# EAGLE design XWiFi (EAGLE 6.3)
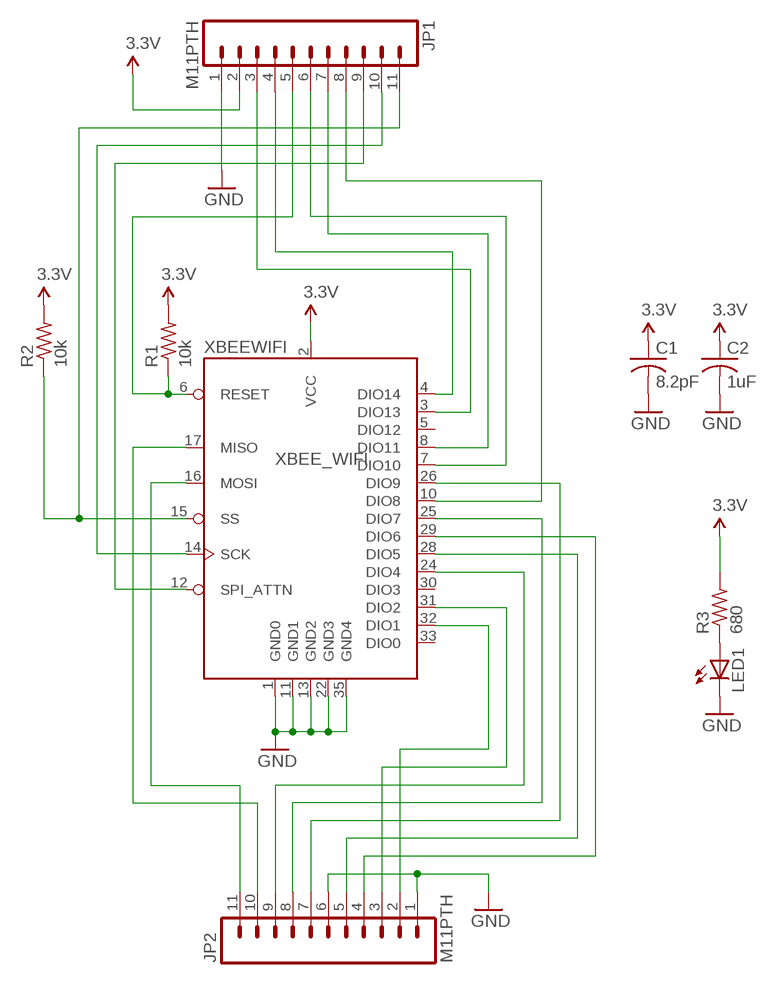
[diagram p0: schematic, sheet 1]

## Parts
C1  8.2pF  0603_CAP  [0603_RESISTOR]
C2  1uF  0603_CAP  [0603_RESISTOR]
JP1  M11PTH  [1X11]
JP2  M11PTH  [1X11]
LED1  LEDCHIP-LED0603  [CHIP-LED0603]
R1  10k  0603_RESISTOR  [0603_RESISTOR]
R2  10k  0603_RESISTOR  [0603_RESISTOR]
R3  680  0603_RESISTOR  [0603_RESISTOR]
XBEEWIFI  XBEE_WIFI  [XBEE_WIFI]

## Nets
3.3V: C1.1 C2.1 JP1.2 R1.2 R2.2 R3.2 XBEEWIFI.2(VCC)
GND: C1.2 C2.2 JP1.1 JP2.1 JP2.6 LED1.C XBEEWIFI.1(GND0) XBEEWIFI.11(GND1) XBEEWIFI.13(GND2) XBEEWIFI.22(GND3) XBEEWIFI.35(GND4)
N$1: JP1.5 R1.1 XBEEWIFI.6(RESET)
N$2: JP1.11 R2.1 XBEEWIFI.15(SS)
N$3: LED1.A R3.1
N$4: JP1.3 XBEEWIFI.3(DIO13)
N$5: JP1.4 XBEEWIFI.4(DIO14)
N$6: JP1.6 XBEEWIFI.7(DIO10)
N$8: JP1.7 XBEEWIFI.8(DIO11)
N$9: JP2.9 XBEEWIFI.24(DIO4)
N$10: JP1.8 XBEEWIFI.10(DIO8)
N$11: JP1.9 XBEEWIFI.12(SPI_ATTN)
N$13: JP1.10 XBEEWIFI.14(SCK)
N$16: JP2.11 XBEEWIFI.16(MOSI)
N$17: JP2.3 XBEEWIFI.31(DIO2)
N$18: JP2.2 XBEEWIFI.32(DIO1)
N$19: JP2.8 XBEEWIFI.25(DIO7)
N$20: JP2.7 XBEEWIFI.26(DIO9)
N$21: JP2.5 XBEEWIFI.28(DIO5)
N$22: JP2.4 XBEEWIFI.29(DIO6)
N$27: JP2.10 XBEEWIFI.17(MISO)
Unconnected: XBEEWIFI.5(DIO12) XBEEWIFI.30(DIO3) XBEEWIFI.33(DIO0)

## Library data of the parts
C1 C2 = jkf-parts:0603_CAP: 0603 Capacitor
JP1 JP2 = SparkFun-Connectors:M11: Header 11 Standard 11-pin 0.1" header. Use with straight break away headers (SKU : PRT-00116), right angle break away headers (PRT-00553), swiss pins (PRT-00743), machine pins (PRT-00117), and female headers (PRT-00115).
LED1 = adafruit:LED: LED OSRAM: - CHIPLED LG R971, LG N971, LY N971, LG Q971, LY Q971, LO R971, LY R971 LH N974, LH R974 LS Q976, LO Q976, LY Q976 LO Q996 - Hyper CHIPLED LW Q18S LB Q993, LB Q99A, LB R99A - SideLED LS A670, LO A670, LY A670, LG A670, LP A670 LB A673, LV A673, LT A673, LW A673 LH A674 LY A675 LS A676, LA A676, LO A676, LY A676, LW A676 LS A679, LY A679, LG A679 - Hyper Micro SIDELED® LS Y876, LA Y876, LO Y876, LY Y876 LT Y87S - SmartLED LW L88C, LW L88S LB L89C, LB L89S, LG L890 LS L89K, LO L89K, LY L89K LS L896, LA L896, LO L896, LY L896 - TOPLED LS T670, LO T670, LY T670, LG T670, LP T670 LSG T670, LSP T670, LSY T670, LOP T670, LYG T670 LG T671, LOG T671, LSG T671 LB T673, LV T673, LT T673, LW T673 LH T674 LS T676, LA T676, LO T676, LY T676, LB T676, LH T676, LSB T676, LW T676 LB T67C, LV T67C, LT T67C, LS T67K, LO T67K, LY T67K, LW E67C LS E67B, LA E67B, LO E67B, LY E67B, LB E67C, LV E67C, LT E67C LW T67C LS T679, LY T679, LG T679 LS T770, LO T770, LY T770, LG T770, LP T770 LB T773, LV T773, LT T773, LW T773 LH T774 LS E675, LA E675, LY E675, LS T675 LS T776, LA T776, LO T776, LY T776, LB T776 LHGB T686 LT T68C, LB T68C - Hyper Mini TOPLED® LB M676 - Mini TOPLED Santana® LG M470 LS M47K, LO M47K, LY M47K Source: http://www.osram.convergy.de/
R1-R3 = jkf-parts:0603_RESISTOR
XBEEWIFI = jkf:XBEE_WIFI

## Board
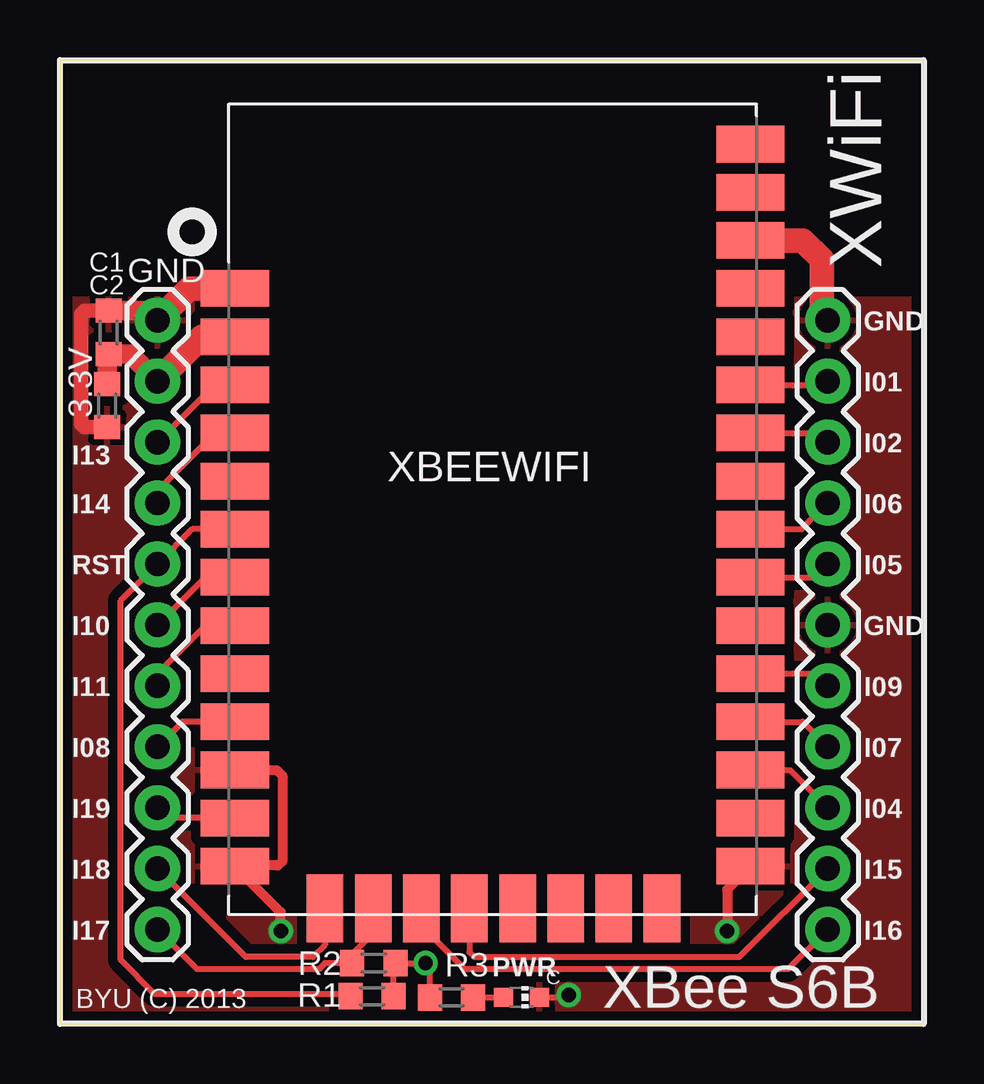
[diagram p1: board, top side]
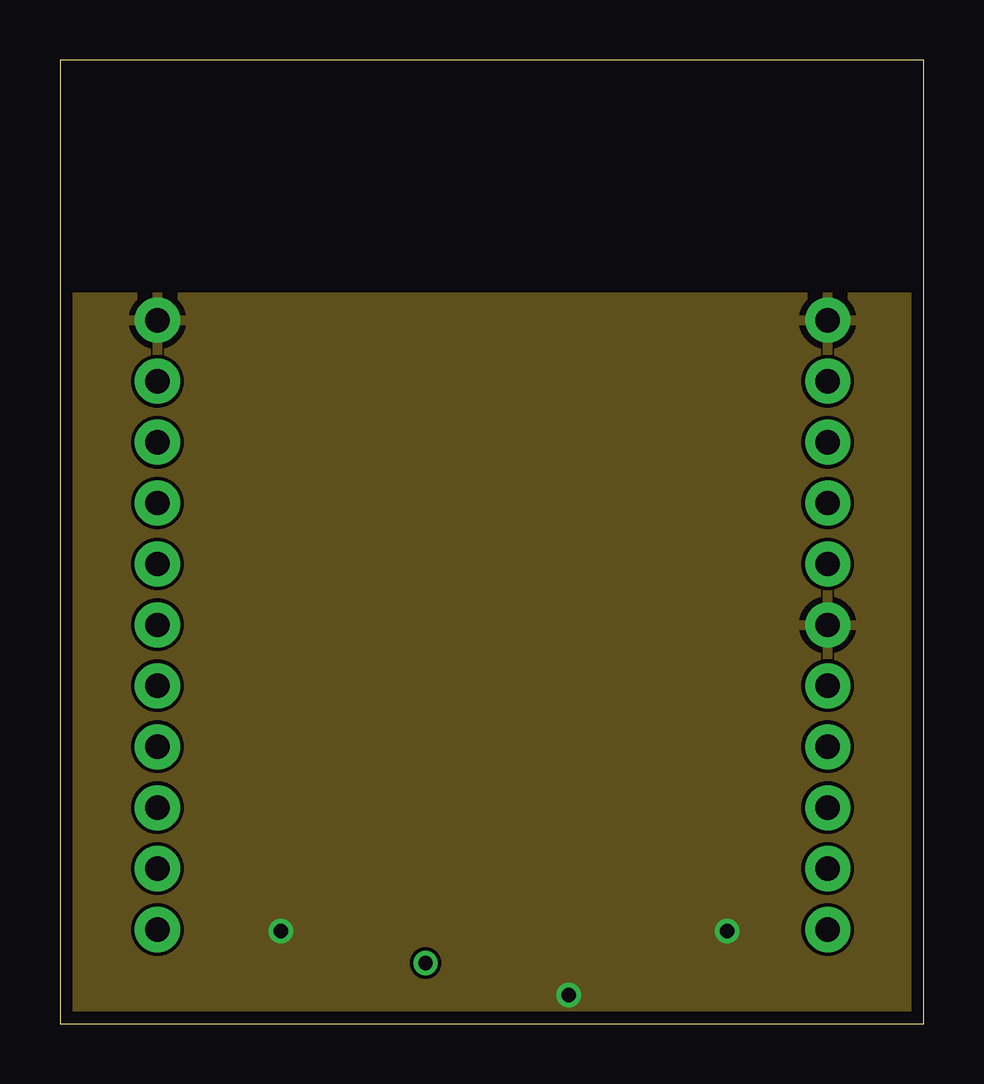
[diagram p2: board, inner layer GND]
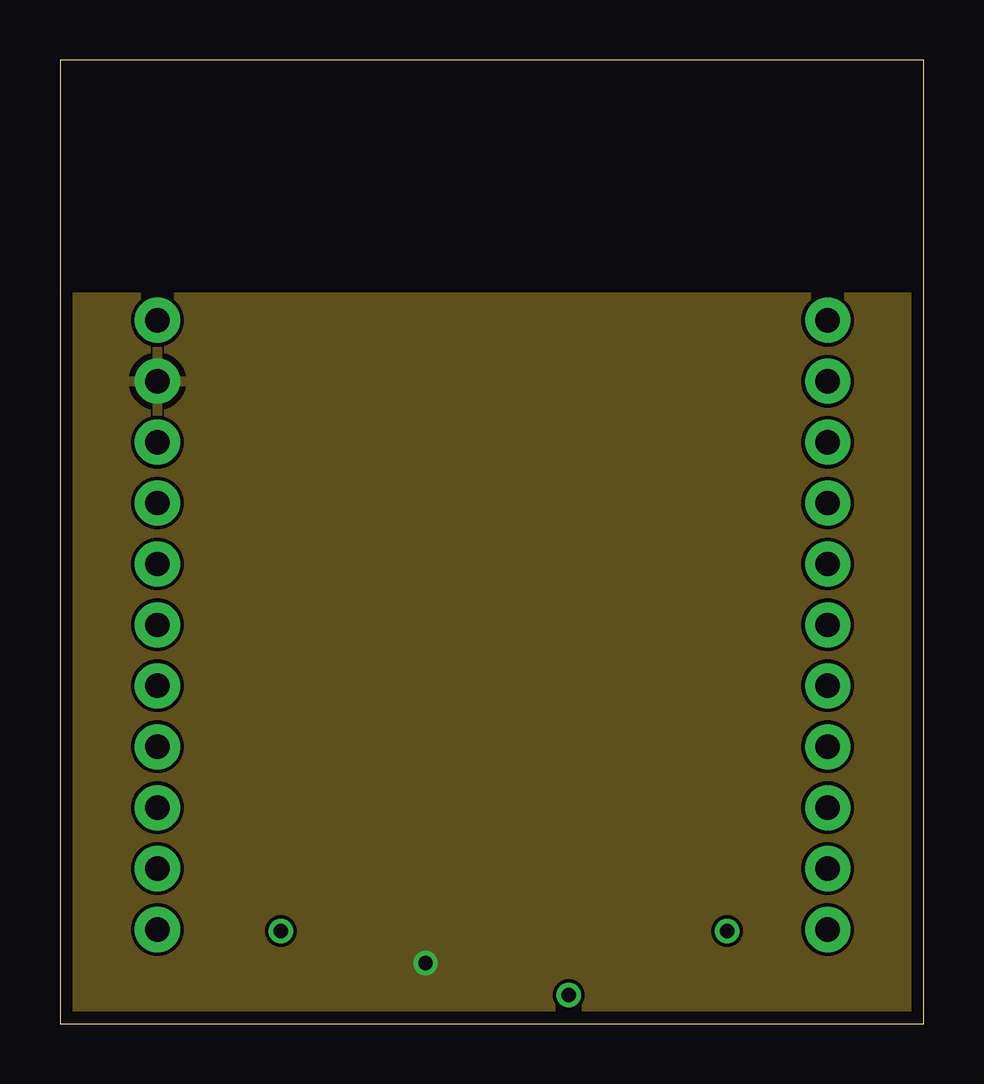
[diagram p3: board, inner layer 3.3V]
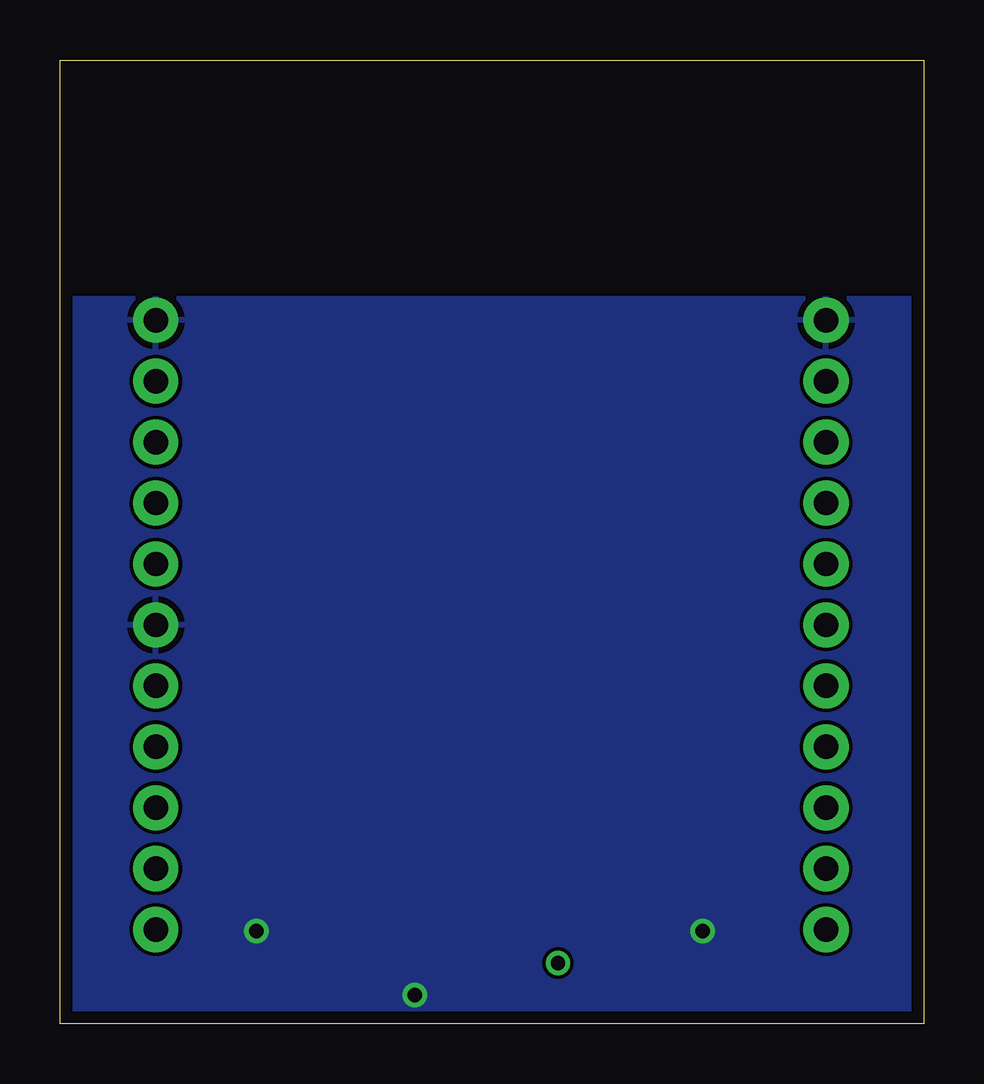
[diagram p4: board, bottom side, seen from below]

Size 36 x 40.19 mm. Coordinates in mm from the lower left corner, seen from the top.
Outline: 0,0 36,0 36,40.19 0,40.19 0,0
Copper layers (1+2*15+16): Top 0.0178mm / dielectric 12mil / GND 0.0356mm / dielectric 28mil / 3.3V 0.0356mm / dielectric 12mil / Bottom 0.0178mm
Design rules "SSC-EAGLE-4Lyr_v1.0.0.3": minimum track width 6mil, minimum drill 8mil, track to track 6mil, track to pad 6mil, pad to pad 6mil, via to via 6mil, smd to smd 6mil, copper to edge 20mil, drill to drill 16mil, minimum pad ring 8mil, minimum via ring 8mil, stop-mask expansion 3mil, vias tented up to drill 0mil, thermal gap 10mil

### Footprints (pad centres in the part's own frame; a part is rotated, then mirrored left to right if it is on the bottom)
0603_RESISTOR = smd 1 x 1.1: 1 -0.9,0; 2 0.9,0
1X11 = drill 1.016 pad 1.88: 1 0,0; 2 2.54,0; 3 5.08,0; 4 7.62,0; 5 10.16,0; 6 12.7,0; 7 15.24,0; 8 17.78,0; 9 20.32,0; 10 22.86,0; 11 25.4,0
CHIP-LED0603 = smd 0.8 x 0.8: A 0,-0.75; C 0,0.75
XBEE_WIFI = smd 2.845 x 1.524: 1 -10.744,9.195; 2 -10.744,7.188; 3 -10.744,5.182; 4 -10.744,3.175; 5 -10.744,1.168; 6 -10.744,-0.838; 7 -10.744,-2.845; 8 -10.744,-4.851; 9 -10.744,-6.858; 10 -10.744,-8.865; 11 -10.744,-10.871; 12 -10.744,-12.878; 13 -10.744,-14.884; 22 10.744,-14.884; 23 10.744,-12.878; 24 10.744,-10.871; 25 10.744,-8.865; 26 10.744,-6.858; 27 10.744,-4.851; 28 10.744,-2.845; 29 10.744,-0.838; 30 10.744,1.168; 31 10.744,3.175; 32 10.744,5.182; 33 10.744,7.188; 34 10.744,9.195; 35 10.744,11.201; 36 10.744,13.208; 37 10.744,15.215 | smd 1.524 x 2.845: 14 -6.985,-16.637; 15 -4.978,-16.637; 16 -2.972,-16.637; 17 -0.965,-16.637; 18 1.041,-16.637; 19 3.048,-16.637; 20 5.055,-16.637; 21 7.061,-16.637

### Placement (x,y rotation side)
C1  2.03,28.83 90 top
C2  1.97,25.78 270 top
JP1  4.06,29.34 270 top
JP2  32,29.34 270 top
LED1  19.24,1.12 270 top
R1  13.01,1.16 0 top
R2  13.08,2.54 0 top
R3  16.32,1.11 180 top
XBEEWIFI  18.03,21.46 0 top

### Tracks (layer width: path | path; a pad name or v marks a point on that pad's centre or on a via)
3.3V  (via drill 0.6)
  Top 0.254: R1.2 13.91,2.47 R2.2 v15.24,2.54 15.42,2.36 R3.2
  Top 0.813: JP1.2 2.93,27.93 C1.1 1.97,27.87 C2.1
  Top 1.016: XBEEWIFI.2 5.92,28.65 JP1.2
  pour 3.3V: -1,30.3 37,30.3 37,-0.87 -1.2,-0.87
GND  (via drill 0.6)
  Top 0.254: LED1.C 21.12,1.11 v21.21,1.21
  Top 0.406: XBEEWIFI.22 27.81,5.61 v27.81,3.87 | XBEEWIFI.11 9.03,10.59 9.27,10.35 9.27,6.79 9.08,6.6 7.32,6.6 XBEEWIFI.13 9.21,4.66 v9.21,3.87
  Top 0.61: C1.2 1.03,29.73 0.89,29.59 0.89,25.02 1.02,24.89 1.96,24.89 C2.2
  Top 0.813: C1.2 3.67,29.73 JP1.1
  Top 1.016: XBEEWIFI.1 5.38,30.66 JP1.1 | XBEEWIFI.35 30.96,32.66 31.75,31.88 31.75,29.59 JP2.1
  pour GND: -1,30.3 37,30.3 37,-0.87 -1.2,-0.87
  pour Bottom: -1.27,30.23 36.83,30.23 36.83,-1.27 -1.27,-1.27
  pour Top (isolate 0.406): -1.27,30.23 6.35,30.23 6.35,4.45 29.21,4.45 29.21,30.23 36.83,30.23 36.83,-1.27 -1.27,-1.27
N$1
  Top 0.254: XBEEWIFI.6 5.51,20.62 JP1.5 2.54,17.65 2.54,2.67 3.94,1.27 12.01,1.27 R1.1
N$2
  Top 0.254: XBEEWIFI.15 13.08,4.8 13.08,3.81 12.18,2.91 R2.1 11.05,2.54 10.79,2.29 5.71,2.29 JP1.11
N$3
  Top 0.254: R3.1 18.48,1.11 LED1.A
N$4
  Top 0.254: XBEEWIFI.3 6.45,26.64 JP1.3
N$5
  Top 0.254: XBEEWIFI.4 6.48,24.64 4.32,22.48 4.32,21.97 JP1.4
N$6
  Top 0.254: XBEEWIFI.7 6.04,18.62 JP1.6
N$8
  Top 0.254: XBEEWIFI.8 6.07,16.61 4.06,14.61 JP1.7
N$9
  Top 0.254: XBEEWIFI.24 30.43,10.59 JP2.9
N$10
  Top 0.254: XBEEWIFI.10 5.11,12.6 JP1.8
N$11
  Top 0.254: XBEEWIFI.12 4.5,8.59 JP1.9
N$13
  Top 0.254: XBEEWIFI.14 11.05,3.3 10.54,2.79 7.75,2.79 JP1.10
N$16
  Top 0.254: JP2.11 30.35,2.29 16.89,2.29 15.24,3.94 15.24,4.65 XBEEWIFI.16
N$17
  Top 0.254: XBEEWIFI.31 31.62,24.64 JP2.3
N$18
  Top 0.254: XBEEWIFI.32 31.85,26.64 JP2.2
N$19
  Top 0.254: XBEEWIFI.25 30.96,12.6 JP2.8
N$20
  Top 0.254: XBEEWIFI.26 31.5,14.61 JP2.7
N$21
  Top 0.254: XBEEWIFI.28 31.45,18.62 JP2.5
N$22
  Top 0.254: XBEEWIFI.29 30.91,20.62 JP2.4
N$27
  Top 0.254: XBEEWIFI.17 17.07,3 17.27,2.79 28.32,2.79 JP2.10

### Text on the board
tPlace: C
tSilk: XWiFi | GND | GND | I01 | 3.3V | I02 | I13 | I14 | I06 | RST | I05 | I10 | GND | I11 | I09 | I08 | I07 | I19 | I04 | I18 | I15 | I17 | I16 | PWR | BYU (C) 2013 | XBee S6B